# EAGLE design csa_auxcpu_addon-v1.0b (EAGLE 4.15)
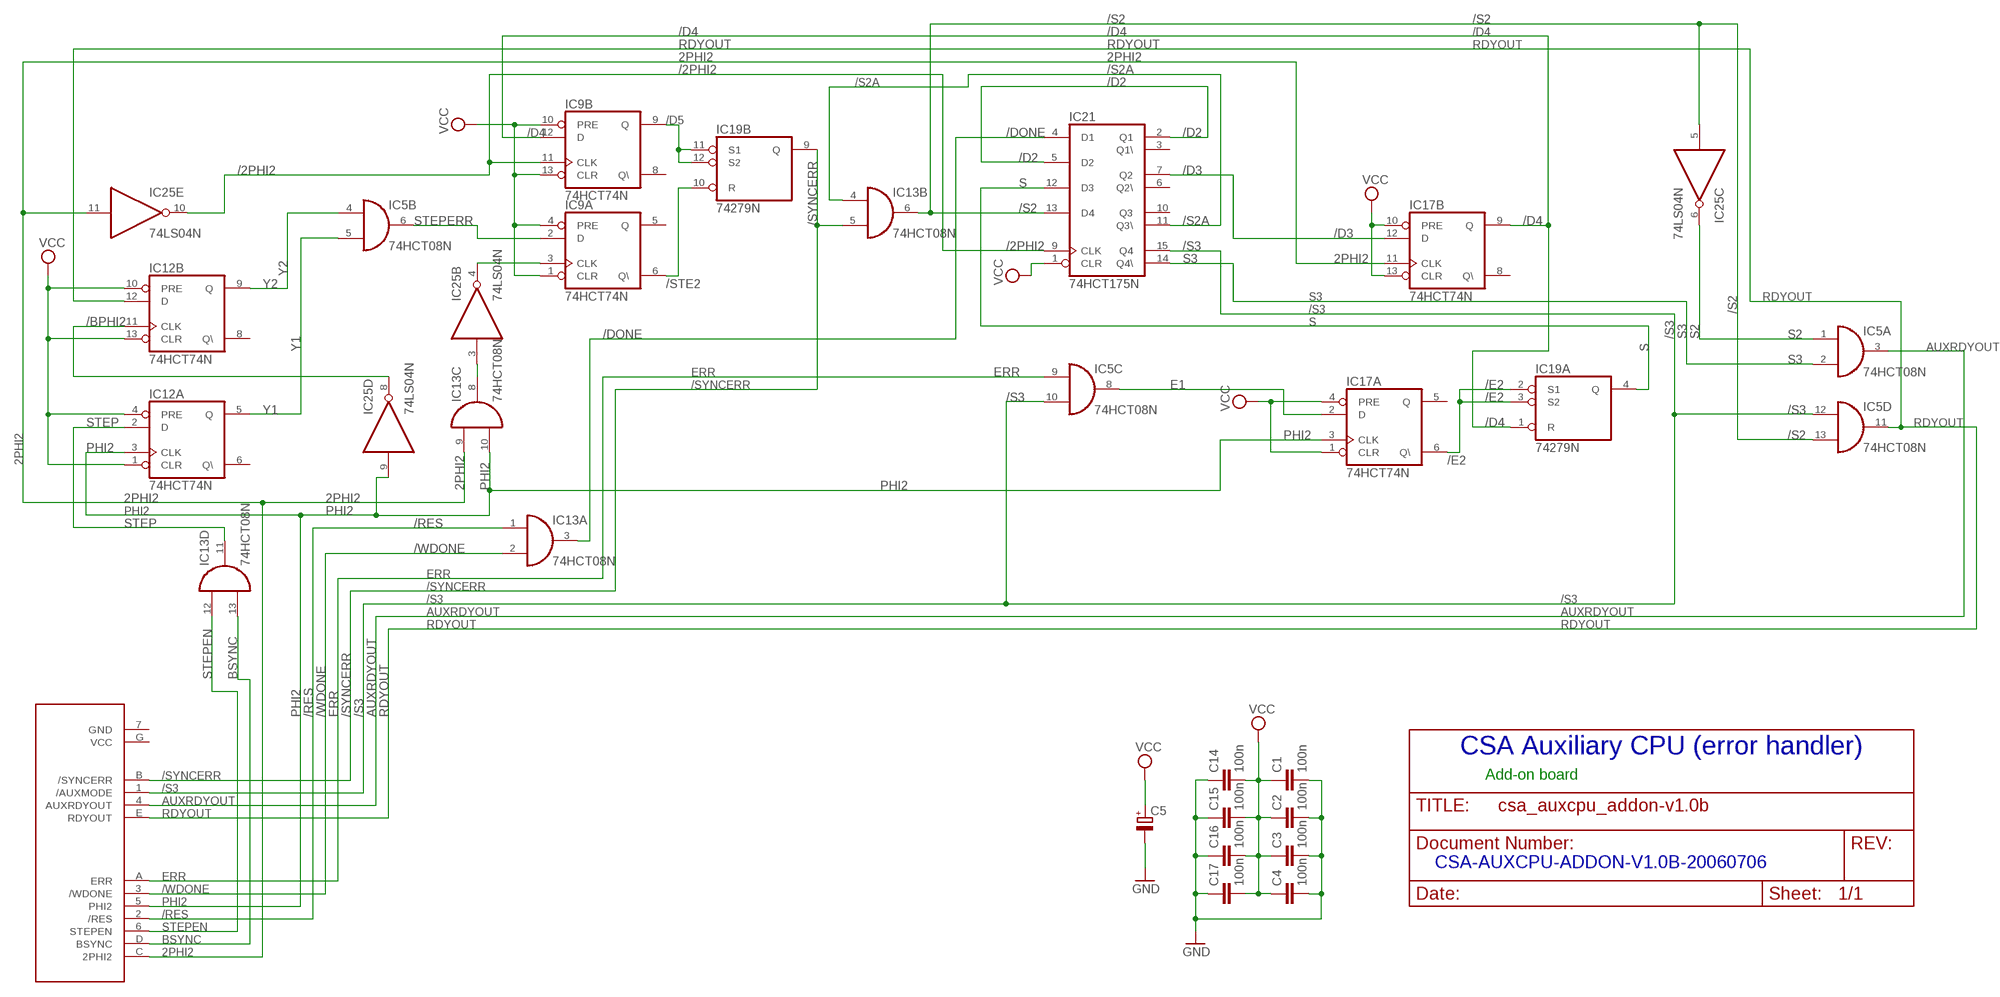
[diagram p0: schematic, sheet 1]

## Parts
C1  100n  C-EU025-025X050  [C025-025X050]
C2  100n  C-EU025-025X050  [C025-025X050]
C3  100n  C-EU025-025X050  [C025-025X050]
C4  100n  C-EU025-025X050  [C025-025X050]
C5  CPOL-EUE2.5-5  [E2,5-5]
C14  100n  C-EU025-025X050  [C025-025X050]
C15  100n  C-EU025-025X050  [C025-025X050]
C16  100n  C-EU025-025X050  [C025-025X050]
C17  100n  C-EU025-025X050  [C025-025X050]
IC5  74HCT08N  [DIL14]
IC9  74HCT74N  [DIL14]
IC12  74HCT74N  [DIL14]
IC13  74HCT08N  [DIL14]
IC17  74HCT74N  [DIL14]
IC19  74279N  [DIL16]
IC21  74HCT175N  [DIL16]
IC25  74LS04N  [DIL14]
P1  CSA_AUXCPU_ADDON  [FLAT14]

## Nets
2PHI2: IC13.9(C:I0) IC17.11(B:CLK) IC25.11(E:I) P1.C(2PHI2)
/2PHI2: IC9.11(B:CLK) IC21.9(CLK) IC25.10(E:O)
/BPHI2: IC12.11(B:CLK) IC25.8(D:O)
/D2: IC21.2(Q1) IC21.5(D2)
/D3: IC17.12(B:D) IC21.7(Q2)
/D4: IC9.12(B:D) IC17.9(B:Q) IC19.1(A:R)
/D5: IC9.9(B:Q) IC19.11(B:S1) IC19.12(B:S2)
/DONE: IC13.3(A:O) IC21.4(D1)
/E2: IC17.6(A:Q\) IC19.2(A:S1) IC19.3(A:S2)
/RES: IC13.1(A:I0) P1.2(/RES)
/S2: IC5.13(D:I1) IC13.6(B:O) IC21.13(D4) IC25.5(C:I)
/S2A: IC13.4(B:I0) IC21.11(Q3\)
/S3: IC5.10(C:I1) IC5.12(D:I0) IC21.15(Q4) P1.1(/AUXMODE)
/STE2: IC9.6(A:Q\) IC19.10(B:R)
/SYNCERR: IC13.5(B:I1) IC19.9(B:Q) P1.B(/SYNCERR)
/WDONE: IC13.2(A:I1) P1.3(/WDONE)
AUXRDYOUT: IC5.3(A:O) P1.4(AUXRDYOUT)
BSYNC: IC13.13(D:I1) P1.D(BSYNC)
E1: IC5.8(C:O) IC17.2(A:D)
ERR: IC5.9(C:I0) P1.A(ERR)
GND: C1.2 C2.2 C3.2 C4.2 C5.- C14.1 C15.1 C16.1 C17.1
N$1: IC9.3(A:CLK) IC25.4(B:O)
N$2: IC13.8(C:O) IC25.3(B:I)
PHI2: IC12.3(A:CLK) IC13.10(C:I1) IC17.3(A:CLK) IC25.9(D:I) P1.5(PHI2)
RDYOUT: IC5.11(D:O) IC12.12(B:D) P1.E(RDYOUT)
S: IC19.4(A:Q) IC21.12(D3)
S2: IC5.1(A:I0) IC25.6(C:O)
S3: IC5.2(A:I1) IC21.14(Q4\)
STEP: IC12.2(A:D) IC13.11(D:O)
STEPEN: IC13.12(D:I0) P1.6(STEPEN)
STEPERR: IC5.6(B:O) IC9.2(A:D)
VCC: C1.1 C2.1 C3.1 C4.1 C5.+ C14.2 C15.2 C16.2 C17.2 IC9.1(A:CLR) IC9.4(A:PRE) IC9.10(B:PRE) IC9.13(B:CLR) IC12.1(A:CLR) IC12.4(A:PRE) IC12.10(B:PRE) IC12.13(B:CLR) IC17.1(A:CLR) IC17.4(A:PRE) IC17.10(B:PRE) IC17.13(B:CLR) IC21.1(CLR)
Y1: IC5.5(B:I1) IC12.5(A:Q)
Y2: IC5.4(B:I0) IC12.9(B:Q)
Unconnected: IC9.5(A:Q) IC9.8(B:Q\) IC12.6(A:Q\) IC12.8(B:Q\) IC17.5(A:Q) IC17.8(B:Q\) IC19.5(C:R) IC19.6(C:S) IC19.7(C:Q) IC19.13(D:Q) IC19.14(D:R) IC19.15(D:S) IC21.3(Q1\) IC21.6(Q2\) IC21.10(Q3) IC25.1(A:I) IC25.2(A:O) IC25.12(F:O) IC25.13(F:I)

## Notes on the sheet
- CSA Auxiliary CPU (error handler)
- Add-on board
- CSA-AUXCPU-ADDON-V1.0B-20060706

## Power pins joined to a net without a drawn wire
GND: IC5.7(P:GND) IC9.7(P:GND) IC12.7(P:GND) IC13.7(P:GND) IC17.7(P:GND) IC19.8(P:GND) IC21.8(GND) IC25.7(P:GND) P1.7(GND)
VCC: IC5.14(P:VCC) IC9.14(P:VCC) IC12.14(P:VCC) IC13.14(P:VCC) IC17.14(P:VCC) IC19.16(P:VCC) IC21.16(VCC) IC25.14(P:VCC) P1.G(VCC)

## Library data of the parts
C1-C4 C14-C17 = rcl:C-EU: CAPACITOR, European symbol
C5 = rcl:CPOL-EU: POLARIZED CAPACITOR, European symbol
IC5 IC13 = 74xx-eu:74*08: Quad 2-input AND gate
IC9 IC12 IC17 = 74xx-eu:74*74: Dual D type positive edge triggered FLIP FLOP, preset and clear
IC19 = 74xx-eu:74*279: Quadruple S-R LATCH
IC21 = 74xx-eu:74*175: Qadruple D type FLIP FLOP, clear
IC25 = 74xx-eu:74*04: Hex INVERTER
P1 = csa:CSA_AUXCPU_ADDON

## Board
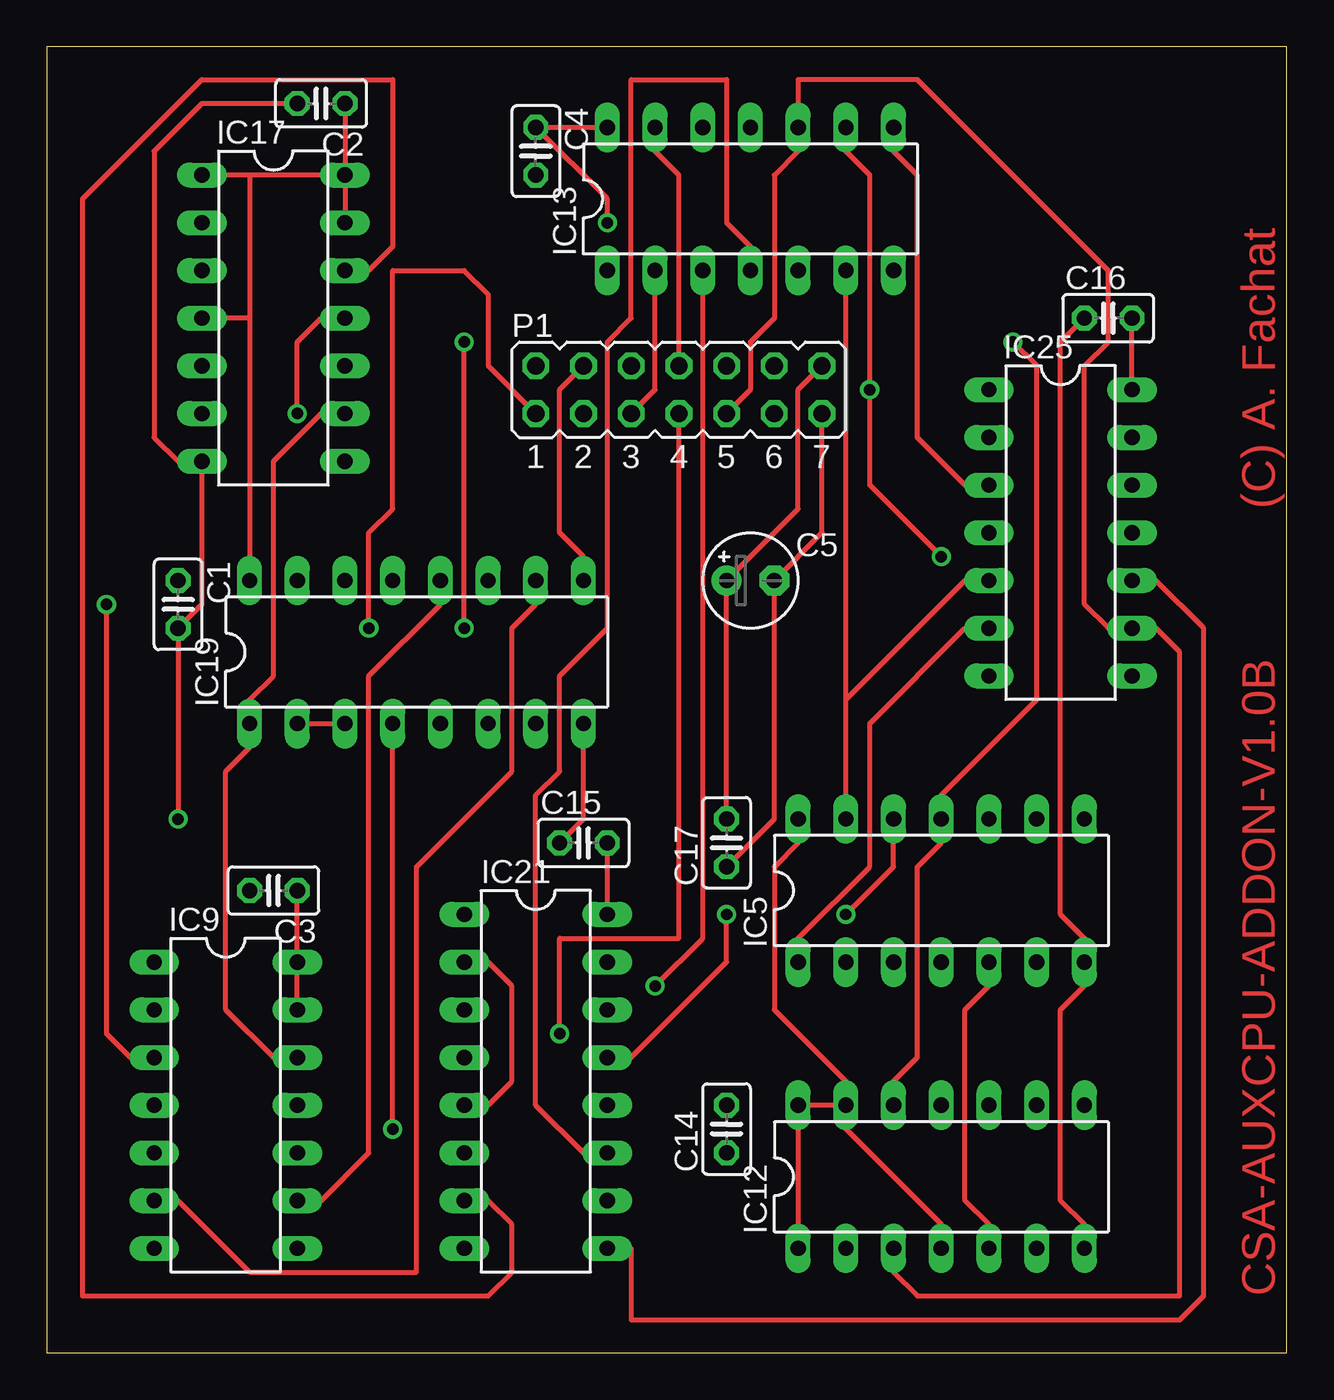
[diagram p1: board, top side]
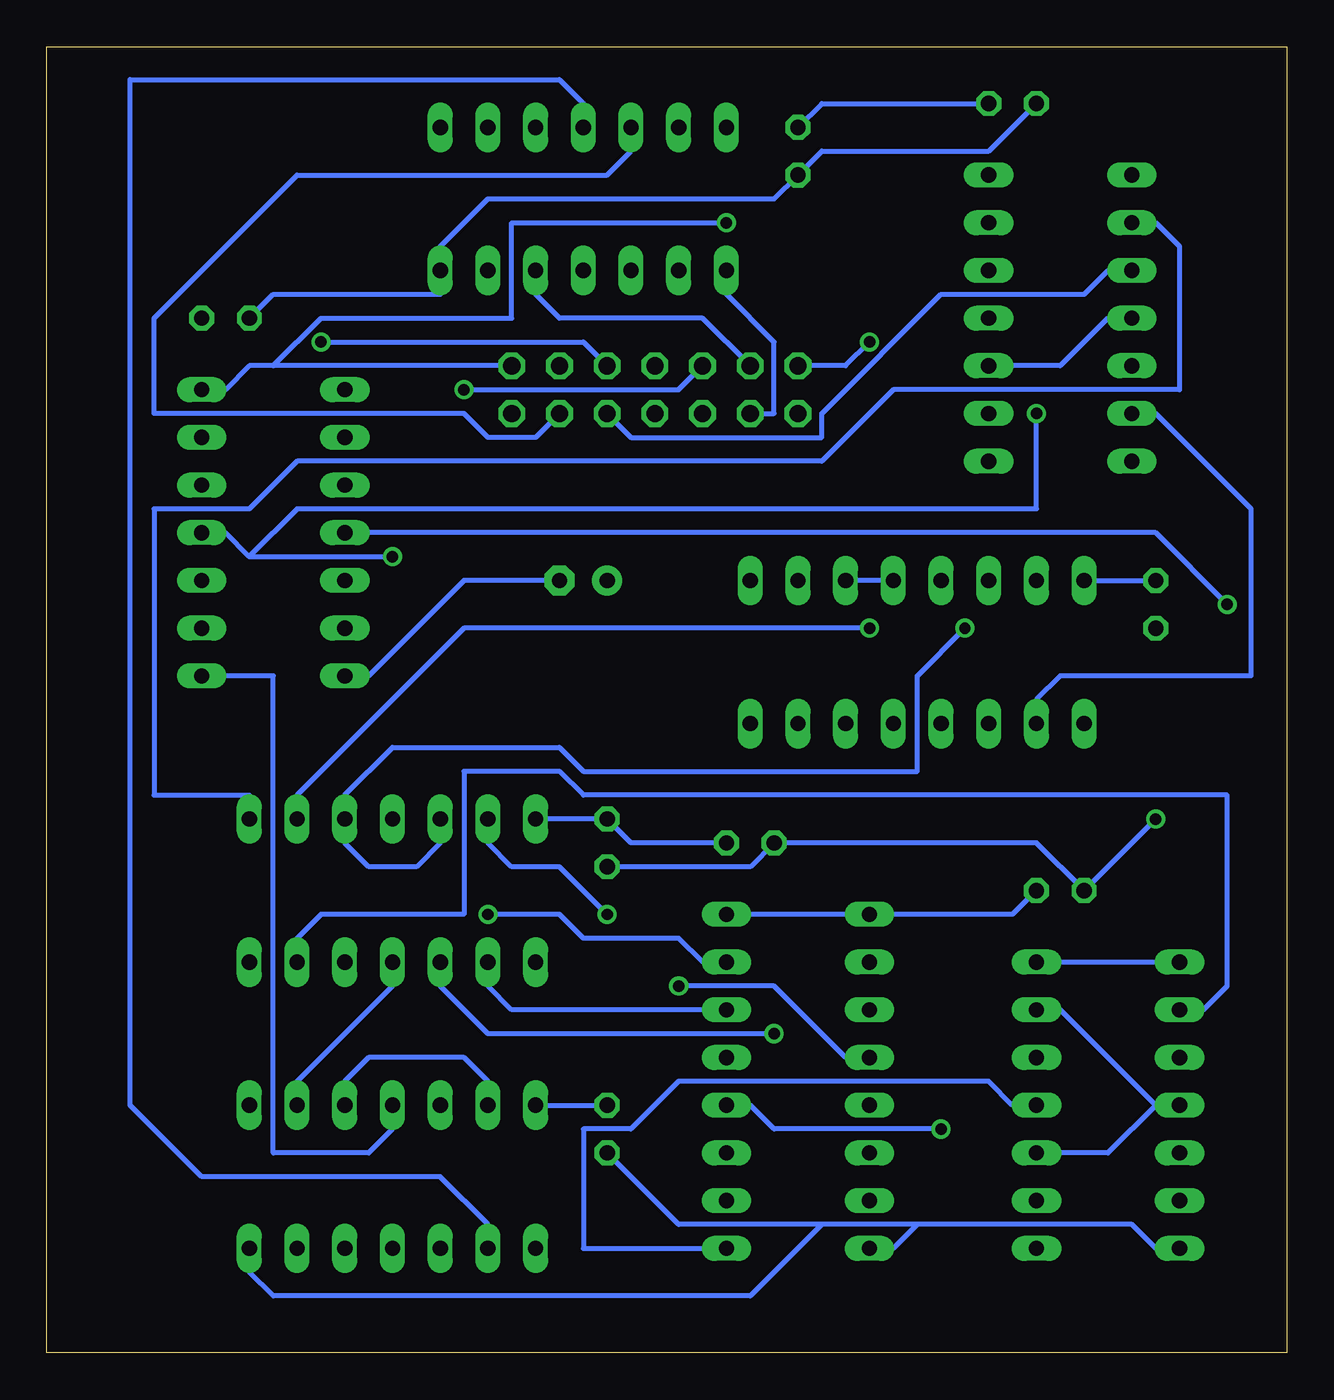
[diagram p2: board, bottom side, seen from below]

Size 66.02 x 69.52 mm. Coordinates in mm from the lower left corner, seen from the top.
Outline: 0,0 66.02,0 66.02,69.52 0,69.52 0,0
Copper layers (1*16): Top 0.035mm / dielectric 1.5mm / Bottom 0.035mm
Design rules "default": minimum track width 10mil, minimum drill 24mil, track to track 8mil, track to pad 8mil, pad to pad 8mil, via to via 8mil, smd to smd 8mil, copper to edge 40mil, drill to drill 8mil, minimum pad ring 10mil, minimum via ring 8mil, stop-mask expansion 4mil, vias tented up to drill 0mil, thermal gap 10mil

### Footprints (pad centres in the part's own frame; a part is rotated, then mirrored left to right if it is on the bottom)
C025-025X050 = drill 0.813 octagon: 1 -1.27,0; 2 1.27,0
E2,5-5 = drill 0.813 pad 1.6 round: + -1.27,0 | drill 0.813 pad 1.6 octagon: - 1.27,0
DIL14 = drill 0.813 long: 1 -7.62,-3.81; 2 -5.08,-3.81; 3 -2.54,-3.81; 4 0,-3.81; 5 2.54,-3.81; 6 5.08,-3.81; 7 7.62,-3.81; 8 7.62,3.81; 9 5.08,3.81; 10 2.54,3.81; 11 0,3.81; 12 -2.54,3.81; 13 -5.08,3.81; 14 -7.62,3.81
DIL16 = drill 0.813 long: 1 -8.89,-3.81; 2 -6.35,-3.81; 3 -3.81,-3.81; 4 -1.27,-3.81; 5 1.27,-3.81; 6 3.81,-3.81; 7 6.35,-3.81; 8 8.89,-3.81; 9 8.89,3.81; 10 6.35,3.81; 11 3.81,3.81; 12 1.27,3.81; 13 -1.27,3.81; 14 -3.81,3.81; 15 -6.35,3.81; 16 -8.89,3.81
FLAT14 = drill 0.914 octagon: 1 -7.62,-1.27; 2 -5.08,-1.27; 3 -2.54,-1.27; 4 0,-1.27; 5 2.54,-1.27; 6 5.08,-1.27; 7 7.62,-1.27; A -7.62,1.27; B -5.08,1.27; C -2.54,1.27; D 0,1.27; E 2.54,1.27; F 5.08,1.27; G 7.62,1.27

### Placement (x,y rotation side)
C1  6.98,39.84 270 top
C2  14.6,66.51 180 top
C3  12.06,24.6 180 top
C4  26.03,63.97 270 top
C5  37.46,41.11 0 top
C14  36.19,11.9 90 top
C15  28.57,27.14 0 top
C16  56.51,55.08 0 top
C17  36.19,27.14 90 top
IC5  47.62,24.6 0 top
IC9  9.52,13.17 270 top
IC12  47.62,9.36 0 top
IC13  37.46,61.43 0 top
IC17  12.06,55.08 270 top
IC19  19.68,37.3 0 top
IC21  26.03,14.44 270 top
IC25  53.97,43.65 270 top
P1  33.65,51.27 0 top

### Tracks (layer width: path | path; a pad name or v marks a point on that pad's centre or on a via)
2PHI2  (via drill 0.61)
  Top 0.254: v47.62,42.38 43.81,46.19 v43.81,51.27 43.81,62.7 42.54,63.97 IC13.9 | v13.33,50 13.33,53.81 14.6,55.08 IC17.11
  Bottom 0.254: 55.24,42.38 56.51,43.65 IC25.11 | 55.24,42.38 v47.62,42.38 | v13.33,50 13.33,44.92 52.7,44.92 55.24,42.38 | P1.C 32.38,51.27 v43.81,51.27
/2PHI2
  Top 0.254: IC25.10 59.05,41.11 61.59,38.57 61.59,3.01 60.32,1.74 31.11,1.74 31.11,5.55 IC21.9
  Bottom 0.254: IC9.11 14.6,13.17 15.87,14.44 32.38,14.44 34.92,11.9 37.46,11.9 37.46,5.55 IC21.9
/BPHI2
  Bottom 0.254: IC12.11 47.62,11.9 48.89,10.63 53.97,10.63 53.97,36.03 IC25.8
/D2
  Top 0.254: IC21.5 23.49,13.17 24.76,14.44 24.76,19.52 23.49,20.79 IC21.2
/D3
  Top 0.254: IC21.7 23.49,8.09 24.76,6.82 24.76,4.28 23.49,3.01 1.9,3.01 1.9,61.43 8.25,67.78 18.41,67.78 18.41,58.89 17.14,57.62 IC17.12
/D4
  Top 0.254: IC9.12 12.06,15.71 9.52,18.25 9.52,30.95 10.79,32.22 IC19.1 10.79,34.76 12.06,36.03 12.06,47.46 14.6,50 IC17.9
/D5
  Top 0.254: IC9.9 14.6,8.09 17.14,10.63 17.14,36.03 20.95,39.84 IC19.12
  Bottom 0.254: IC19.12 IC19.11
/DONE  (via drill 0.61)
  Top 0.254: v32.38,19.52 34.92,22.06 IC13.3
  Bottom 0.254: v32.38,19.52 27.3,19.52 23.49,15.71 IC21.4
/E2
  Top 0.254: IC19.2 IC19.3
  Bottom 0.254: IC17.6 6.98,50 1.9,44.92 1.9,36.03 12.06,36.03 13.33,34.76 IC19.2
/RES
  Bottom 0.254: P1.2 27.3,50 27.3,53.81 29.84,56.35 IC13.1
/S2  (via drill 0.61)
  Top 0.254: v36.19,23.33 36.19,20.79 31.11,15.71 IC21.13 | 42.54,34.76 48.89,41.11 IC25.5 | IC5.13 42.54,34.76 | 42.54,34.76 IC13.6
  Bottom 0.254: v36.19,23.33 38.73,25.87 41.27,25.87 42.54,27.14 IC5.13
/S2A
  Top 0.254: IC21.11 28.57,10.63 26.03,13.17 26.03,29.68 27.3,30.95 27.3,36.03 29.84,38.57 29.84,53.81 31.11,55.08 31.11,67.78 36.19,67.78 36.19,60.16 37.46,58.89 IC13.4
/S3  (via drill 0.61)
  Top 0.254: v42.54,23.33 45.08,25.87 IC5.12 | P1.1 23.49,52.54 23.49,56.35 22.22,57.62 18.41,57.62 18.41,44.92 17.14,43.65 v17.14,38.57
  Bottom 0.254: v42.54,23.33 38.73,23.33 37.46,22.06 32.38,22.06 31.11,20.79 IC21.15 | IC5.12 45.08,27.14 46.35,25.87 48.89,25.87 50.16,27.14 IC5.10 50.16,29.68 47.62,32.22 38.73,32.22 37.46,30.95 19.68,30.95 19.68,36.03 v17.14,38.57
/STE2
  Top 0.254: IC9.6 6.98,8.09 10.79,4.28 19.68,4.28 19.68,25.87 24.76,30.95 24.76,38.57 26.03,39.84 IC19.10
/SYNCERR
  Top 0.254: P1.B 27.3,51.27 27.3,43.65 28.57,42.38 IC19.9
  Bottom 0.254: P1.B 31.11,55.08 38.73,55.08 40,56.35 IC13.5
/WDONE
  Top 0.254: P1.3 32.38,51.27 IC13.2
AUXRDYOUT  (via drill 0.61)
  Top 0.254: v27.3,16.98 27.3,22.06 33.65,22.06 P1.4
  Bottom 0.254: v27.3,16.98 42.54,16.98 45.08,19.52 IC5.3
BSYNC
  Top 0.254: P1.D 33.65,62.7 32.38,63.97 IC13.13
E1
  Bottom 0.254: IC17.2 6.98,60.16 5.71,58.89 5.71,51.27 20.95,51.27 24.76,47.46 52.7,47.46 55.24,44.92 60.32,44.92 60.32,29.68 55.24,29.68 IC5.8
ERR  (via drill 0.61)
  Top 0.254: v22.22,38.57 v22.22,53.81
  Bottom 0.254: v22.22,38.57 43.81,38.57 52.7,29.68 IC5.9 | v22.22,53.81 23.49,52.54 P1.A
GND  (via drill 0.61)
  Top 0.254: IC12.7 55.24,6.82 53.97,8.09 53.97,18.25 55.24,19.52 IC5.7 55.24,22.06 53.97,23.33 53.97,53.81 C16.1 | C15.1 28.57,28.41 IC19.8 | C17.1 38.73,28.41 C5.- 41.27,43.65 P1.7 | C2.2 8.25,66.51 5.71,63.97 5.71,48.73 6.98,47.46 IC17.7 8.25,39.84 C1.2 v6.98,28.41
  Bottom 0.254: 19.68,6.82 8.25,6.82 6.98,5.55 IC9.7 | 19.68,6.82 20.95,5.55 IC21.8 | C14.1 32.38,6.82 24.76,6.82 | 19.68,6.82 24.76,6.82 | 24.76,6.82 28.57,3.01 53.97,3.01 55.24,4.28 IC12.7 | C5.- 43.81,41.11 48.89,36.03 IC25.7 | C17.1 28.57,25.87 C15.1 13.33,27.14 C3.2 v6.98,28.41 | C16.1 53.97,56.35 45.08,56.35 IC13.7 45.08,58.89 42.54,61.43 27.3,61.43 C4.2 24.76,63.97 15.87,63.97 C2.2
N$1  (via drill 0.61)
  Top 0.254: v3.17,39.84 3.17,16.98 4.44,15.71 IC9.3
  Bottom 0.254: v3.17,39.84 6.98,43.65 IC25.4
N$2
  Top 0.254: IC25.3 48.89,46.19 46.35,48.73 46.35,62.7 45.08,63.97 IC13.8
PHI2
  Top 0.254: IC12.3 45.08,4.28 46.35,3.01 60.32,3.01 60.32,37.3 59.05,38.57 IC25.9 56.51,38.57 55.24,39.84 55.24,52.54 56.51,53.81 56.51,57.62 46.35,67.78 40,67.78 IC13.10 40,63.97 38.73,62.7 38.73,55.08 37.46,53.81 37.46,51.27 P1.5
  Bottom 0.254: P1.5 34.92,48.73 24.76,48.73 24.76,50 18.41,56.35 10.79,56.35 9.52,57.62 IC17.3
RDYOUT  (via drill 0.61)
  Top 0.254: IC12.12 45.08,14.44 46.35,15.71 46.35,25.87 47.62,27.14 IC5.11 47.62,29.68 52.7,34.76 52.7,52.54 v51.43,53.81
  Bottom 0.254: P1.E 37.46,53.81 v51.43,53.81
S  (via drill 0.61)
  Top 0.254: v18.41,11.9 IC19.4
  Bottom 0.254: v18.41,11.9 27.3,11.9 28.57,13.17 IC21.12
S2
  Top 0.254: IC5.1 40,22.06 43.81,25.87 43.81,33.49 48.89,38.57 IC25.6
S3
  Bottom 0.254: IC21.14 41.27,18.25 42.54,19.52 IC5.2
STEP
  Bottom 0.254: IC12.2 42.54,6.82 45.08,9.36 57.78,9.36 61.59,13.17 61.59,67.78 38.73,67.78 37.46,66.51 IC13.11
STEPEN
  Bottom 0.254: P1.6 40,48.73 42.54,48.73 43.81,50 60.32,50 60.32,55.08 52.7,62.7 36.19,62.7 34.92,63.97 IC13.12
STEPERR
  Bottom 0.254: IC9.2 4.44,18.25 3.17,19.52 3.17,29.68 37.46,29.68 38.73,30.95 43.81,30.95 43.81,23.33 51.43,23.33 52.7,22.06 IC5.6
VCC  (via drill 0.61)
  Top 0.254: IC13.14 C4.1 29.84,61.43 v29.84,60.16 | IC17.14 IC17.13 | 10.79,62.7 IC17.1 | IC17.14 10.79,62.7 | C2.1 IC17.14 | 10.79,62.7 10.79,55.08 | 10.79,55.08 IC19.16 | 10.79,55.08 IC17.4 | IC25.14 C16.2 | P1.G 40,51.27 40,44.92 C5.+ C17.2 | IC12.1 IC12.14 IC12.13 | IC12.4 47.62,6.82 42.54,11.9 IC12.13 | IC9.13 IC9.14 C3.1 | IC21.16 C15.2 | IC12.13 42.54,14.44 38.73,18.25 38.73,25.87 40,27.14 IC5.14
  Bottom 0.254: IC17.4 9.52,55.08 12.06,52.54 IC17.10 | IC19.16 C1.1 | C4.1 24.76,66.51 C2.1 | P1.G 53.97,52.54 | 53.97,52.54 55.24,52.54 56.51,51.27 IC25.14 | IC12.14 C14.2 | IC12.10 50.16,14.44 48.89,15.71 43.81,15.71 42.54,14.44 IC12.13 | 6.98,13.17 9.52,10.63 IC9.10 | IC9.14 IC9.1 | 6.98,13.17 12.06,18.25 IC9.13 | IC9.4 6.98,13.17 | IC5.14 C17.2 34.92,27.14 C15.2 | IC21.16 IC21.1 14.6,23.33 C3.1 | v29.84,60.16 41.27,60.16 41.27,55.08 51.43,55.08 53.97,52.54
Y1
  Top 0.254: IC12.5 50.16,6.82 48.89,8.09 48.89,18.25 50.16,19.52 IC5.5
Y2
  Bottom 0.254: IC12.9 52.7,14.44 47.62,19.52 IC5.4

### Text on the board
Top: (C) A. Fachat | CSA-AUXCPU-ADDON-V1.0B